# EAGLE schematic potencia (EAGLE 7.2.0)
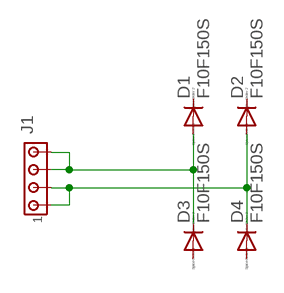
[diagram p0: schematic, sheet 1]

## Parts
D1  F10F150S  FES08AT  [DO220S]
D2  F10F150S  FES08AT  [DO220S]
D3  F10F150S  FES08AT  [DO220S]
D4  F10F150S  FES08AT  [DO220S]
J1  MTA04-156  [1X4MTA]

## Nets
N$3: D2.A D4.C J1.1 J1.2
N$4: D1.A D3.C J1.3 J1.4
Unconnected: D1.C D2.C D3.A D4.A

## Library data of the parts
D1-D4 = diode:FES08AT: DIODE ultra-fast recovery rectifier
J1 = con-amp:MTA04-156: AMP connector